# Altium project Jewel_ESP32.PrjPcb
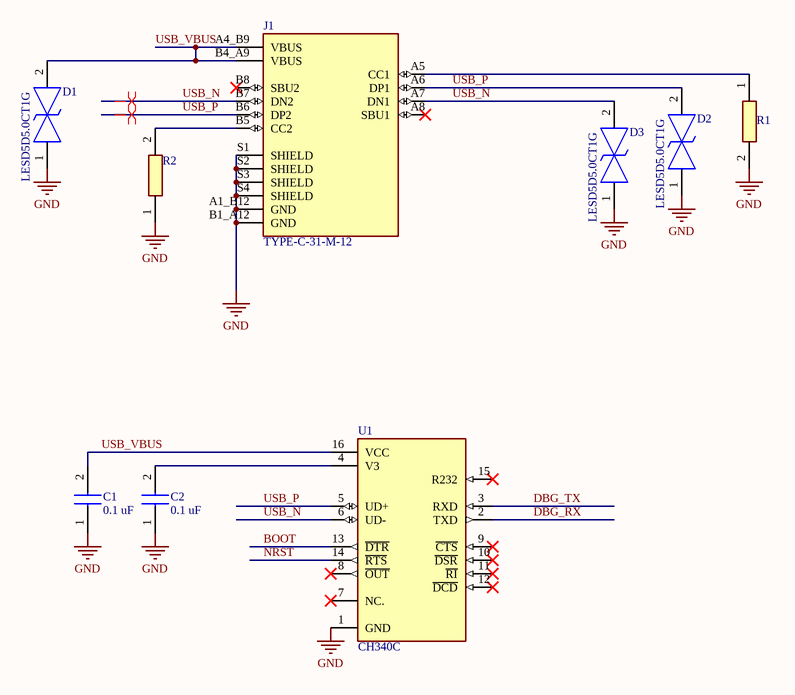
[diagram p0: programmer.SchDoc]
7 sheets, 133 parts. Net scope: global (net labels, ports and power ports of the same name join across sheets).
Board file: PCB1.PcbDoc
Sheets:
  programmer.SchDoc
  MCU.SchDoc
  PWR.SchDoc
  GSM.SchDoc
  RS485.SchDoc
  ADC.SchDoc
  DAC_OUT.SchDoc

## Sheet programmer.SchDoc
size A; SheetNumber: 1; SheetTotal: 7

### Parts
C1  0.1 uF  [CAP0603]
C2  0.1 uF  [CAP0603]
D1  LESD5D5.0CT1G  [LESD5D50CT1G]
D2  LESD5D5.0CT1G  [LESD5D50CT1G]
D3  LESD5D5.0CT1G  [LESD5D50CT1G]
J1  TYPE-C-31-M-12  [HRO_TYPE-C-31-M-12]
R1  CRCW0402100KFKEDHP  [RESC1005X40N]  (value not drawn)
R2  CRCW0402100KFKEDHP  [RESC1005X40N]  (value not drawn)
U1  CH340C  [SOIC127P600X180-16N]

### Nets
GND: C1.1 C2.1 D1.1 D2.1 D3.1 J1.A1_B12(GND) J1.B1_A12(GND) J1.S1(SHIELD) J1.S2(SHIELD) J1.S3(SHIELD) J1.S4(SHIELD) R1.2 R2.1 U1.1(GND)
BOOT: U1.13(~{DTR})
DBG_RX: U1.2(TXD)
DBG_TX: U1.3(RXD)
NRST: U1.14(~{RTS})
USB_N: D3.2 J1.A7(DN1) J1.B7(DN2) U1.6(UD-)
USB_P: D2.2 J1.A6(DP1) J1.B6(DP2) U1.5(UD+)
USB_VBUS: C1.2 D1.2 J1.A4_B9(VBUS) J1.B4_A9(VBUS) U1.16(VCC)
NetC2_2: C2.2 U1.4(V3)
NetJ1_A5: J1.A5(CC1) R1.1
NetJ1_B5: J1.B5(CC2) R2.2

Not connected (* = marked no-connect by the designer): J1 A8(SBU1)* B8(SBU2)*; U1 7(NC.)* 8(~{OUT})* 9(~{CTS})* 10(~{DSR})* 11(~{RI})* 12(~{DCD})* 15(R232)*

### Layout directives
differential pair: USB_N, USB_P

### Library data of the parts
C1 C2 = CC0603KRX7R9BB104: Capacitor; Manufacturer_Name: YAGEO; Datasheet Link: https://componentsearchengine.com/Datasheets/2/CC0603KRX7R9BB104.pdf; Height: 0.9mm; Manufacturer_Part_Number: CC0603KRX7R9BB104; Mouser Part Number: 603-CC603KRX7R9BB104; Mouser Price/Stock: https://www.mouser.co.uk/ProductDetail/YAGEO/CC0603KRX7R9BB104?qs=vTakOoo5QyLvVCYM2ge8LQ%3D%3D; Arrow Part Number: CC0603KRX7R9BB104; Arrow Price/Stock: https://www.arrow.com/en/products/cc0603krx7r9bb104/yageo?utm_currency=USD&region=europe
D1-D3 = LESD5D5.0CT1G: TVS Diode (Bi-directional); Manufacturer_Name: LRC; Height: 0.7mm; Manufacturer_Part_Number: LESD5D5.0CT1G
J1 = TYPE-C-31-M-12: USB Connectors 24 Receptacle 1 8.94*7.3mm RoHS; MF: HRO Electronics Co., Ltd.; SnapEDA_Link: https://www.snapeda.com/parts/TYPE-C-31-M-12/HRO+Electronics+Co.%252C+Ltd./view-part/?ref=snap; Package: Package; Value: *; MP: TYPE-C-31-M-12; Check_prices: https://www.snapeda.com/parts/TYPE-C-31-M-12/HRO+Electronics+Co.%252C+Ltd./view-part/?ref=eda
R1 R2 = CRCW0402100KFKEDHP: Resistor; Manufacturer_Name: Vishay; Datasheet Link: http://www.vishay.com/docs/20035/dcrcwe3.pdf; Height: 0.4mm; Manufacturer_Part_Number: CRCW0402100KFKEDHP; Mouser Part Number: 71-CRCW0402100KFKEDH; Mouser Price/Stock: https://www.mouser.co.uk/ProductDetail/Vishay-Dale/CRCW0402100KFKEDHP?qs=k2%2FDWSARqgGFakjlJe4Ejw%3D%3D; Arrow Part Number: CRCW0402100KFKEDHP; Arrow Price/Stock: https://www.arrow.com/en/products/crcw0402100kfkedhp/vishay?utm_currency=USD&region=nac
U1 = CH340C: USB to serial chip CH340; MF: WCH; Price: None; Availability: Not in stock; MP: CH340C; Package: None; SnapEDA_Link: https://www.snapeda.com/parts/CH340C/WCH/view-part/?ref=snap; Check_prices: https://www.snapeda.com/parts/CH340C/WCH/view-part/?ref=eda; Value: *

## Sheet MCU.SchDoc
size A3; SheetNumber: 2; SheetTotal: 7
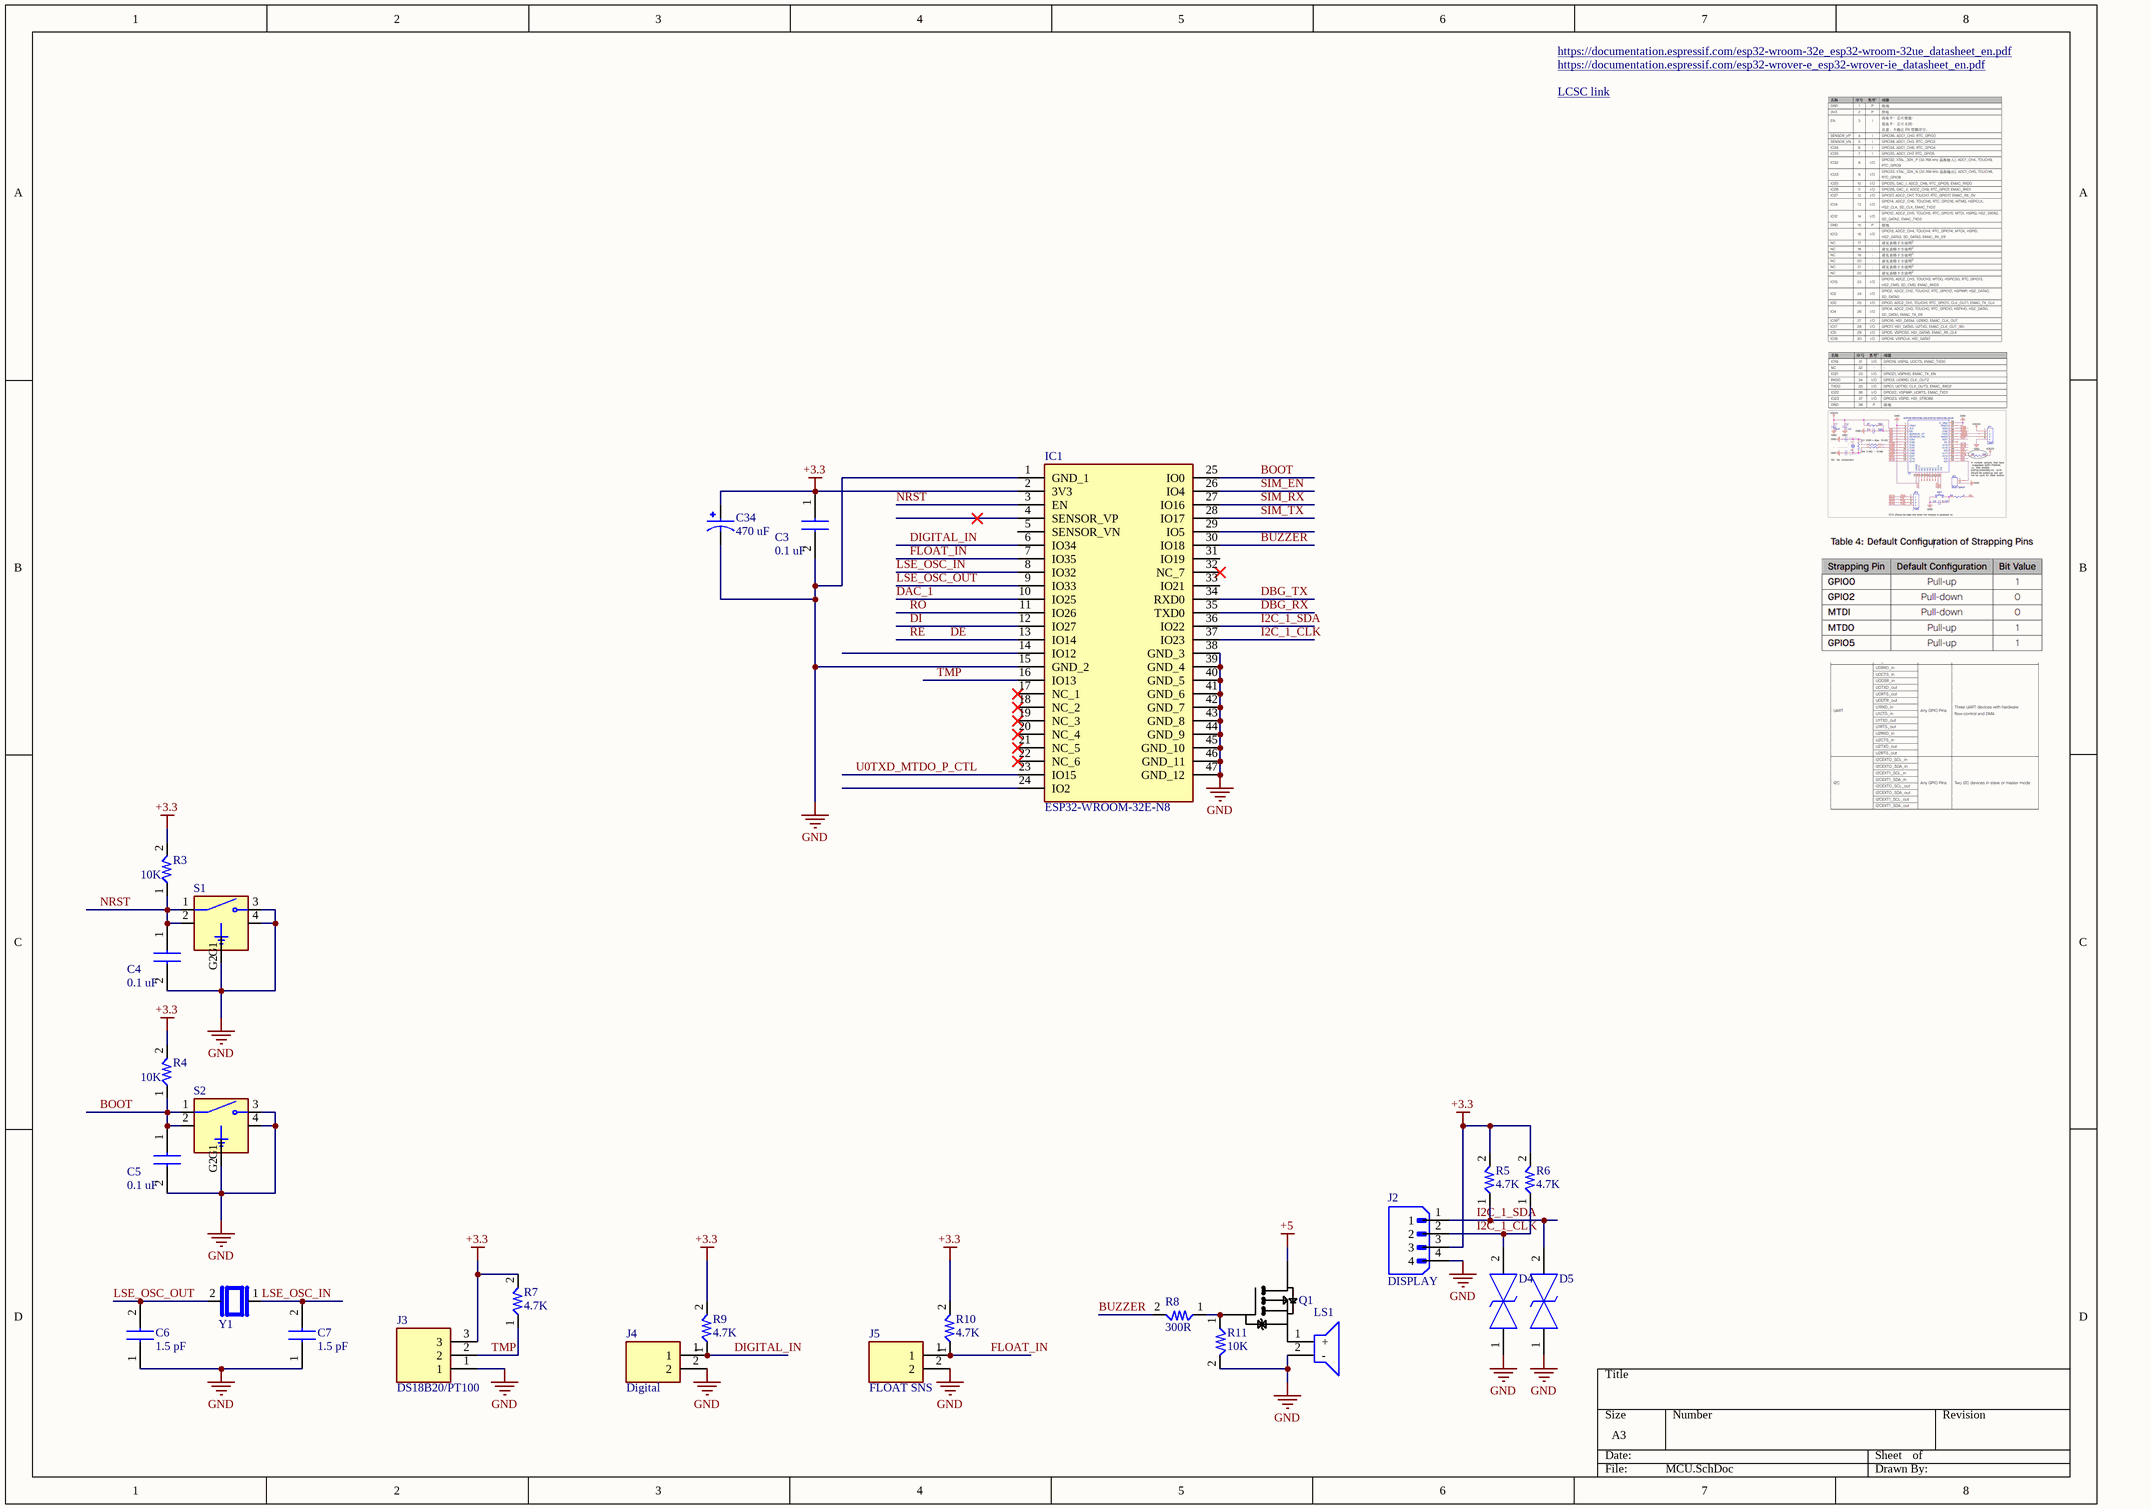
[diagram p1: MCU.SchDoc]

### Parts
C3  0.1 uF  [CAP0603]
C4  0.1 uF  [CAP0603]
C5  0.1 uF  [CAP0603]
C6  1.5 pF  [CAP0603]
C7  1.5 pF  [CAP0603]
C34  470 uF  [CAPPRD350W60D800H1150]
D4  DESD3V3Z1BCSF-7  [DESD3V3Z1BCSF7]  (value not drawn)
D5  DESD3V3Z1BCSF-7  [DESD3V3Z1BCSF7]  (value not drawn)
IC1  ESP32-WROOM-32E-N8  [ESP32WROOM32EN8]
J2  DISPLAY  [JST_B4B-XH-A(LF)(SN)]
J3  DS18B20/PT100  [2828153]
J4  Digital  [SHDRRA2W102P0X508_1X2_1016X1200X850P]
J5  FLOAT SNS  [SHDRRA2W102P0X508_1X2_1016X1200X850P]
LS1  CMI-1295IC-0585T  [CMI1295IC0585T]  (value not drawn)
Q1  DMG3415U-7  [SOT96P240X110-3N]  (value not drawn)
R3  10K  [RES0603]
R4  10K  [RES0603]
R5  4.7K  [RES0603]
R6  4.7K  [RES0603]
R7  4.7K  [RES0603]
R8  300R  [RES0603]
R9  4.7K  [RES0603]
R10  4.7K  [RES0603]
R11  10K  [RES0603]
S1  PTS526_SMG15_SMTR2_LFS  [SW_PTS526_SMG15_SMTR2_LFS]  (value not drawn)
S2  PTS526_SMG15_SMTR2_LFS  [SW_PTS526_SMG15_SMTR2_LFS]  (value not drawn)
Y1  CM8V-T1A-32.768KHZ-6PF-20PPM-TA-QC  [XTAL_CM8V-T1A-32.768KHZ-6PF-20PPM-TA-QC]  (value not drawn)

### Nets
+3.3: C3.1 C34.P IC1.2(3V3) J2.3 J3.3 R3.2 R4.2 R5.2 R6.2 R7.2 R9.2 R10.2
+5: Q1.3(D)
GND: C3.2 C4.2 C5.2 C6.1 C7.1 C34.N D4.1 D5.1 IC1.1(GND_1) IC1.15(GND_2) IC1.38(GND_3) IC1.39(GND_4) IC1.40(GND_5) IC1.41(GND_6) IC1.42(GND_7) IC1.43(GND_8) IC1.44(GND_9) IC1.45(GND_10) IC1.46(GND_11) IC1.47(GND_12) J2.4 J3.1 J4.2 J5.2 LS1.2(-) R11.2 S1.3(NO) S1.4(NO) S1.G2(GND) S2.3(NO) S2.4(NO) S2.G2(GND)
BOOT: C5.1 IC1.25(IO0) R4.1 S2.1(COM) S2.2(COM)
BUZZER: IC1.30(IO18) R8.2
DAC_1: IC1.10(IO25)
DBG_RX: IC1.35(TXD0)
DBG_TX: IC1.34(RXD0)
DE: IC1.13(IO14)  [also labelled RE]
DI: IC1.12(IO27)
DIGITAL_IN: IC1.6(IO34) J4.1 R9.1
FLOAT_IN: IC1.7(IO35) J5.1 R10.1
I2C_1_CLK: D4.2 IC1.37(IO23) J2.2 R6.1
I2C_1_SDA: D5.2 IC1.36(IO22) J2.1 R5.1
LSE_OSC_IN: C7.2 IC1.8(IO32) Y1.1
LSE_OSC_OUT: C6.2 IC1.9(IO33) Y1.2
NRST: C4.1 IC1.3(EN) R3.1 S1.1(COM) S1.2(COM)
RO: IC1.11(IO26)
SIM_EN: IC1.26(IO4)
SIM_RX: IC1.27(IO16)
SIM_TX: IC1.28(IO17)
TMP: IC1.16(IO13) J3.2 R7.1
U0TXD_MTDO_P_CTL: IC1.23(IO15)
NetLS1_1: LS1.1(+) Q1.2(S)
NetQ1_1: Q1.1(G) R8.1 R11.1

Not connected (* = marked no-connect by the designer): IC1 4(SENSOR_VP)* 5(SENSOR_VN) 14(IO12) 17(NC_1)* 18(NC_2)* 19(NC_3)* 20(NC_4)* 21(NC_5)* 22(NC_6)* 24(IO2) 29(IO5) 31(IO19) 32(NC_7)* 33(IO21); S1 G1(GND); S2 G1(GND)

### Notes on the sheet
- https://documentation.espressif.com/esp32-wroom-32e_esp32-wroom-32ue_datasheet_en.pdf
- https://documentation.espressif.com/esp32-wrover-e_esp32-wrover-ie_datasheet_en.pdf
- LCSC link <https://www.lcsc.com/product-detail/C701342.html?s_z=n_q_t_esp32&spm=wm.fly.bg.3.xh___wm.ssy.tc.0.tz&lcsc_vid=EVJdVVYDQlEPAgBWRwALVwJWFlQKUQJQQwdXUVRSQFIxVlNeRlBXXlJfTlRXVDsOAxUeFF5JWBYZEEoKFBINSQcJGk4dAgUUFAk%3D>

### Library data of the parts
C3-C7 = CC0603KRX7R9BB104: Capacitor; Manufacturer_Name: YAGEO; Datasheet Link: https://componentsearchengine.com/Datasheets/2/CC0603KRX7R9BB104.pdf; Height: 0.9mm; Manufacturer_Part_Number: CC0603KRX7R9BB104; Mouser Part Number: 603-CC603KRX7R9BB104; Mouser Price/Stock: https://www.mouser.co.uk/ProductDetail/YAGEO/CC0603KRX7R9BB104?qs=vTakOoo5QyLvVCYM2ge8LQ%3D%3D; Arrow Part Number: CC0603KRX7R9BB104; Arrow Price/Stock: https://www.arrow.com/en/products/cc0603krx7r9bb104/yageo?utm_currency=USD&region=europe
C34 = EEUFC1E221: 220F 25V Aluminum Electrolytic Capacitors Radial, Can 2000 Hrs @ 105C; MF: Panasonic; Package: RADIAL-2 Panasonic; Price: None; Purchase-URL: https://pricing.snapeda.com/search/part/EEUFC1E221/?ref=eda; Value: *; Check_prices: https://www.snapeda.com/parts/EEUFC1E221/Panasonic/view-part/?ref=eda; MP: EEUFC1E221; SnapEDA_Link: https://www.snapeda.com/parts/EEUFC1E221/Panasonic/view-part/?ref=snap; Availability: In Stock
D4 D5 = DESD3V3Z1BCSF-7: TVS Diode (Bi-directional); Manufacturer_Name: Diodes Incorporated; Datasheet Link: https://www.diodes.com/assets/Package-Files/X2-WLB0603-2.pdf; Height: 0.32mm; Manufacturer_Part_Number: DESD3V3Z1BCSF-7; Mouser Part Number: 621-DESD3V3Z1BCSF-7; Mouser Price/Stock: https://www.mouser.co.uk/ProductDetail/Diodes-Incorporated/DESD3V3Z1BCSF-7?qs=HXFqYaX1Q2xS5VnKZuyjmg%3D%3D; Arrow Part Number: DESD3V3Z1BCSF-7; Arrow Price/Stock: https://www.arrow.com/en/products/desd3v3z1bcsf-7/diodes-incorporated?utm_currency=USD&region=nac
IC1 = ESP32-WROOM-32E-N8: Integrated Circuit; Manufacturer_Name: Espressif Systems; Datasheet Link: https://www.google.com/url?sa=t&rct=j&q=&esrc=s&source=web&cd=&ved=2ahUKEwjLw4ysybv2AhXFzIUKHZUbB64QFnoECCwQAQ&url=https%3A%2F%2Fwww.espressif.com%2Fsites%2Fdefault%2Ffiles%2Fdocumentation%2Fesp32-wroom-32e_esp32-wroom-32ue_datasheet_en.pdf&usg=AOvVaw1xSL; Height: 3.25mm; Manufacturer_Part_Number: ESP32-WROOM-32E-N8; Mouser Part Number: 356-ESP32WRM32E164PH; Mouser Price/Stock: https://www.mouser.co.uk/ProductDetail/Espressif-Systems/ESP32-WROOM-32E-N8?qs=Li%252BoUPsLEnsLnZW%252BGLgUhw%3D%3D
J2 = B4B-XH-A(LF)(SN): Connector Header Through Hole 4 position 0.098 (2.50mm); MF: JST Sales; SnapEDA_Link: https://www.snapeda.com/parts/B4B-XH-A(LF)(SN)/JST+Sales+America+Inc./view-part/?ref=snap; Package: None; Value: *; MP: B4B-XH-A(LF)(SN); Check_prices: https://www.snapeda.com/parts/B4B-XH-A(LF)(SN)/JST+Sales+America+Inc./view-part/?ref=eda
J3 = 282815-3: Connector; Manufacturer_Name: TE Connectivity; Datasheet Link: https://www.te.com/commerce/DocumentDelivery/DDEController?Action=srchrtrv&DocNm=1-773958-1&DocType=Data%20Sheet&DocLang=English&PartCntxt=282815-3&DocFormat=pdf; Height: 8.35mm; Manufacturer_Part_Number: 282815-3; Mouser Part Number: 571-282815-3; Mouser Price/Stock: https://www.mouser.co.uk/ProductDetail/TE-Connectivity/282815-3?qs=79%2FjLZ2kXkqd6grVMiPYfw%3D%3D; Arrow Part Number: 282815-3; Arrow Price/Stock: https://www.arrow.com/en/products/282815-3/te-connectivity
J4 J5 = 282815-2: Connector; Manufacturer_Name: TE Connectivity; Datasheet Link: https://www.te.com/commerce/DocumentDelivery/DDEController?Action=srchrtrv&DocNm=1-773958-1&DocType=Data%20Sheet&DocLang=English&PartCntxt=282815-2&DocFormat=pdf; Height: 8.5mm; Manufacturer_Part_Number: 282815-2; Mouser Part Number: 571-282815-2; Mouser Price/Stock: https://www.mouser.co.uk/ProductDetail/TE-Connectivity/282815-2?qs=79%2FjLZ2kXkpF7MFURi982A%3D%3D; Arrow Part Number: 282815-2; Arrow Price/Stock: https://www.arrow.com/en/products/282815-2/te-connectivity?region=nac
LS1 = CMI-1295IC-0585T: Loudspeaker or Buzzer; Manufacturer_Name: Same Sky; Datasheet Link: https://www.sameskydevices.com/product/resource/CMI-1295IC-0585T.pdf; Height: 9.7mm; Manufacturer_Part_Number: CMI-1295IC-0585T; Mouser Part Number: 490-CMI-1295IC-0585T; Mouser Price/Stock: https://www.mouser.co.uk/ProductDetail/Same-Sky/CMI-1295IC-0585T?qs=OlC7AqGiEDkuskN%2Fok3iNw%3D%3D; Arrow Part Number: CMI-1295IC-0585T; Arrow Price/Stock: https://www.arrow.com/en/products/cmi-1295ic-0585t/cui-devices?utm_currency=USD&region=nac
Q1 = DMG3415U-7: Integrated Circuit; Manufacturer_Name: Lattice Semiconductor; Datasheet Link: https://media.digikey.com/pdf/Data%20Sheets/Diodes%20PDFs/DMG3415U.pdf; Height: 1.1mm; Manufacturer_Part_Number: DMG3415U-7; Mouser Part Number: N/A; Mouser Price/Stock: https://www.mouser.com/Search/Refine.aspx?Keyword=N%2FA
R3-R11 = RES: Resistor; Manufacturer_Name: UNI-ROYAL(Uniroyal Elec); Manufacturer_Part_Number: 0603WAF1001T5E; Datasheet Link: https://datasheet.lcsc.com/szlcsc/Uniroyal-Elec-0603WAF1001T5E_C21190.pdf; Height: 0.55mm
S1 S2 = PTS526_SMG15_SMTR2_LFS: Tactile Switch SPST-NO Top Actuated Surface Mount; MP: PTS526 SMG15 SMTR2 LFS; MF: C&K; Availability: In Stock; SnapEDA_Link: https://www.snapeda.com/parts/PTS526%20SMG15%20SMTR2%20LFS/C%2526K/view-part/?ref=snap; Value: *; Package: None; Price: None; Purchase-URL: https://pricing.snapeda.com/search/part/PTS526 SMG15 SMTR2 LFS/?ref=eda; Check_prices: https://www.snapeda.com/parts/PTS526%20SMG15%20SMTR2%20LFS/C%2526K/view-part/?ref=eda
Y1 = CM8V-T1A-32.768KHZ-6PF-20PPM-TA-QC: Tuning Fork Crystal 32.768kHz in SMD 1.2 x 2.0mm package; MF: Micro Crystal; SnapEDA_Link: https://www.snapeda.com/parts/CM8V-T1A-32.768kHz-6pF-20PPM-TA-QC/Micro+Crystal/view-part/?ref=snap; Package: SMD-2 Micro Crystal; Value: *; MP: CM8V-T1A-32.768kHz-6pF-20PPM-TA-QC; Check_prices: https://www.snapeda.com/parts/CM8V-T1A-32.768kHz-6pF-20PPM-TA-QC/Micro+Crystal/view-part/?ref=eda

## Sheet PWR.SchDoc
size A; SheetNumber: 3; SheetTotal: 7
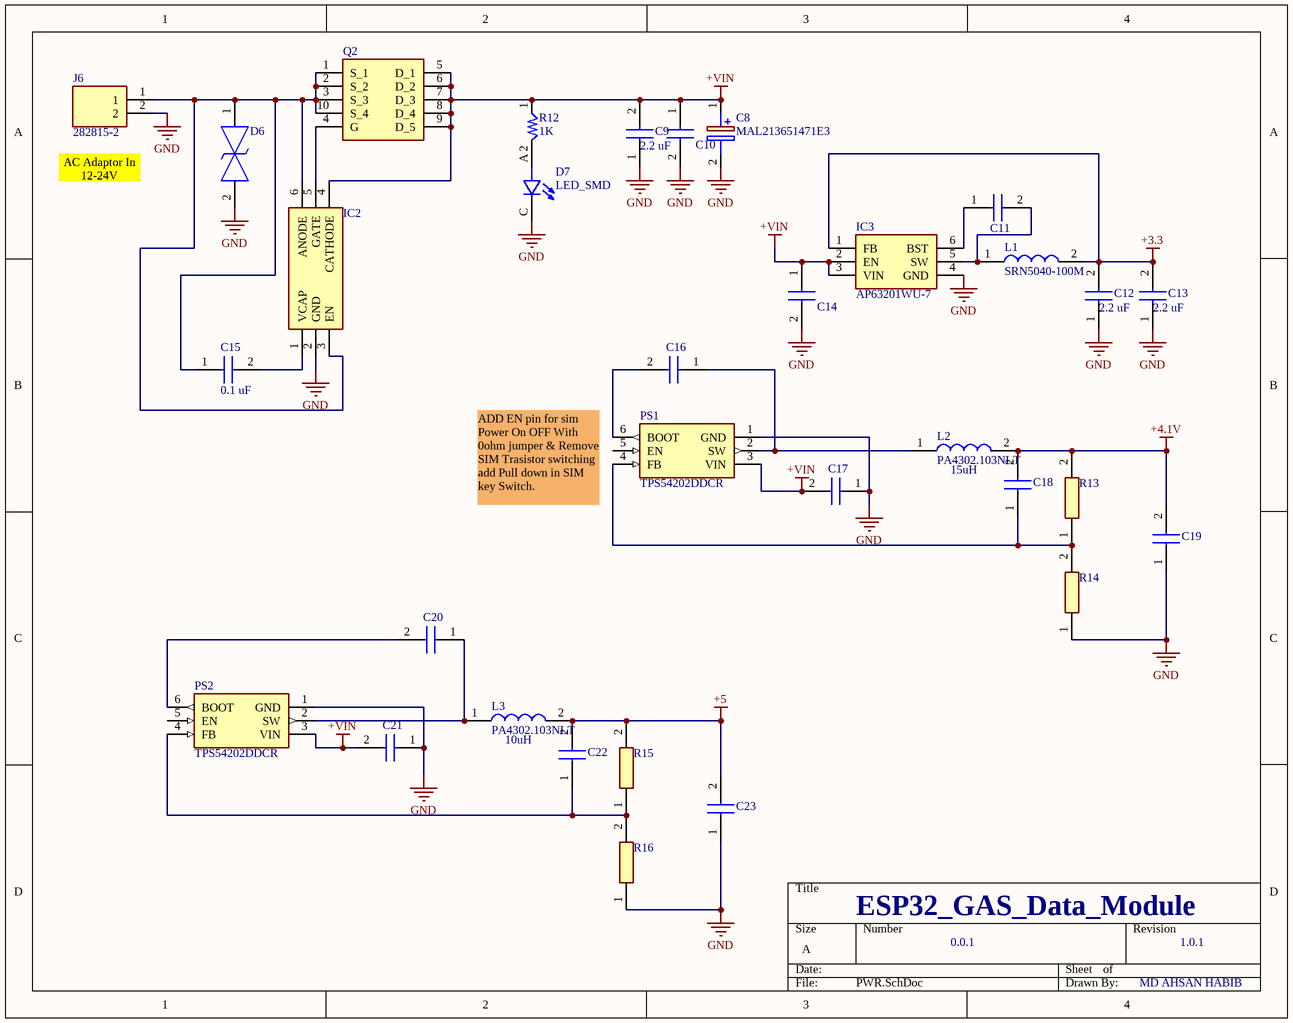
[diagram p2: PWR.SchDoc]

### Parts
C8  MAL213651471E3  [CAPPRD500W60D1300H2700]
C9  2.2 uF  [CAP0603]
C10  C5750X5R1H106K230KA  [C5750_Commercial]  (value not drawn)
C11  C0805C104M5RAC-TU  [CAP0603]  (value not drawn)
C12  2.2 uF  [CAP0603]
C13  2.2 uF  [CAP0603]
C14  C5750X5R1H106K230KA  [CAP0603]  (value not drawn)
C15  0.1 uF  [CAP0603]
C16  C0805C104M5RAC-TU  [CAPC2012X88N]  (value not drawn)
C17  C5750X5R1H106K230KA  [CAP0603]  (value not drawn)
C18  GRM0335C1E560JA01D  [CAP0603]  (value not drawn)
C19  GRM32ER61C476KE15L  [CAPC3225X270N]  (value not drawn)
C20  C0805C104M5RAC-TU  [CAPC2012X88N]  (value not drawn)
C21  C5750X5R1H106K230KA  [CAP0603]  (value not drawn)
C22  CGA1A2C0G1E820J030BA  [CAP0603]  (value not drawn)
C23  GRM32ER61C476KE15L  [CAPC3225X270N]  (value not drawn)
D6  SMBJ24CA-13-F  [DIONM5336X250N]  (value not drawn)
D7  LED_SMD  [LEDSC125X200X90-2N]
IC2  LM74700QDBVTQ1  [SOT95P280X145-6N]  (value not drawn)
IC3  AP63201WU-7  [SOT95P280X100-6N]
J6  282815-2  [SHDRRA2W102P0X508_1X2_1016X1200X850P]
L1  SRN5040-100M  [SRN5040]
L2  PA4302.103NLT  [PA4302103NLT]
L3  PA4302.103NLT  [PA4302103NLT]
PS1  TPS54202DDCR  [SOT95P280X110-6N]
PS2  TPS54202DDCR  [SOT95P280X110-6N]
Q2  BSC014N06NSATMA1  [BSC010N04LS6ATMA1]  (value not drawn)
R12  1K  [RES0603]
R13  CRCW0402100KFKEDHP  [RES0603]  (value not drawn)
R14  CRCW040216K9FKEDHP  [RES0603]  (value not drawn)
R15  CRCW0402100KFKEDHP  [RES0603]  (value not drawn)
R16  CRCW040213K7FKEDHP  [RES0603]  (value not drawn)

### Nets
+3.3: C12.2 C13.2 IC3.1(FB) L1.2
+4.1V: C18.2 C19.2 L2.2 R13.2
+5: C22.2 C23.2 L3.2 R15.2
+VIN: C8.1(+) C9.2 C10.1 C14.1 C17.2 C21.2 IC2.4(CATHODE) IC3.2(EN) IC3.3(VIN) PS1.3(VIN) PS2.3(VIN) Q2.5(D_1) Q2.6(D_2) Q2.7(D_3) Q2.8(D_4) Q2.9(D_5) R12.1
GND: C8.2(-) C9.1 C10.2 C12.1 C13.1 C14.2 C17.1 C19.1 C21.1 C23.1 D6.2 D7.C IC2.2(GND) IC3.4(GND) J6.2 PS1.1(GND) PS2.1(GND) R14.1 R16.1
NetC11_1: C11.1 IC3.6(BST)
NetC11_2: C11.2 IC3.5(SW) L1.1
NetC15_1: C15.1 D6.1 IC2.3(EN) IC2.6(ANODE) J6.1 Q2.1(S_1) Q2.2(S_2) Q2.3(S_3) Q2.10(S_4)
NetC15_2: C15.2 IC2.1(VCAP)
NetC16_1: C16.1 L2.1 PS1.2(SW)
NetC16_2: C16.2 PS1.6(BOOT)
NetC18_1: C18.1 PS1.4(FB) R13.1 R14.2
NetC20_1: C20.1 L3.1 PS2.2(SW)
NetC20_2: C20.2 PS2.6(BOOT)
NetC22_1: C22.1 PS2.4(FB) R15.1 R16.2
NetD7_A: D7.A R12.2
NetIC2_5: IC2.5(GATE) Q2.4(G)

Not connected (* = marked no-connect by the designer): PS1 5(EN); PS2 5(EN)

### Notes on the sheet
- (near J6) AC Adaptor In 12-24V
- (near PS1) ADD EN pin for sim Power On OFF With 0ohm jumper & Remove SIM Trasistor switching add Pull down in SIM key Switch.
- (near L2) 15uH
- (near L3) 10uH
- ESP32_GAS_Data_Module
- 0.0.1
- 1.0.1
- MD AHSAN HABIB

### Library data of the parts
C8 = MAL213651471E3: Capacitor Polarised; Manufacturer_Name: Vishay; Datasheet Link: https://www.mouser.co.uk/datasheet/2/427/136rvi-1762300.pdf; Height: 27mm; Manufacturer_Part_Number: MAL213651471E3; Mouser Part Number: 594-2222-136-51471; Mouser Price/Stock: https://www.mouser.co.uk/ProductDetail/Vishay-BC-Components/MAL213651471E3?qs=zGH8QOQ14qXx9%252BWDTpPwWA%3D%3D
C9 C12 C13 C15 = CC0603KRX7R9BB104: Capacitor; Manufacturer_Name: YAGEO; Datasheet Link: https://componentsearchengine.com/Datasheets/2/CC0603KRX7R9BB104.pdf; Height: 0.9mm; Manufacturer_Part_Number: CC0603KRX7R9BB104; Mouser Part Number: 603-CC603KRX7R9BB104; Mouser Price/Stock: https://www.mouser.co.uk/ProductDetail/YAGEO/CC0603KRX7R9BB104?qs=vTakOoo5QyLvVCYM2ge8LQ%3D%3D; Arrow Part Number: CC0603KRX7R9BB104; Arrow Price/Stock: https://www.arrow.com/en/products/cc0603krx7r9bb104/yageo?utm_currency=USD&region=europe
C10 C14 C17 C21 = C5750X5R1H106K230KA: Capacitor; Manufacturer_Name: TDK; Datasheet Link: https://product.tdk.com/system/files/dam/doc/product/capacitor/ceramic/mlcc/catalog/mlcc_commercial_general_en.pdf; Height: 2.5mm; Manufacturer_Part_Number: C5750X5R1H106K230KA; Mouser Part Number: 810-C5750X5R1H106K; Mouser Price/Stock: https://www.mouser.co.uk/ProductDetail/TDK/C5750X5R1H106K230KA?qs=NRhsANhppD8lVYAvl0MZ3g%3D%3D; Arrow Part Number: C5750X5R1H106K230KA; Arrow Price/Stock: https://www.arrow.com/en/products/c5750x5r1h106k230ka/tdk?region=nac
C11 C16 C20 = C0805C104M5RAC-TU: Capacitor; Manufacturer_Name: Yageo Group; Datasheet Link: https://connect.kemet.com:7667/gateway/IntelliData-ComponentDocumentation/1.0/download/specsheet/C0805C104M5RACTU; Height: 0.88mm; Manufacturer_Part_Number: C0805C104M5RAC-TU; Arrow Part Number: C0805C104M5RAC-TU; Arrow Price/Stock: https://www.arrow.com/en/products/c0805c104m5ractu/kemet-corporation?region=nac
C18 = GRM0335C1E560JA01D: Capacitor; Manufacturer_Name: Murata Electronics; Height: 0.33mm; Manufacturer_Part_Number: GRM0335C1E560JA01D; Mouser Part Number: 81-GRM0335C1E560JA1D; Mouser Price/Stock: https://www.mouser.com/Search/Refine.aspx?Keyword=81-GRM0335C1E560JA1D; Arrow Part Number: GRM0335C1E560JA01D; Arrow Price/Stock: https://www.arrow.com/en/products/grm0335c1e560ja01d/murata-manufacturing
C19 C23 = GRM32ER61C476KE15L: Capacitor; Manufacturer_Name: Murata Electronics; Datasheet Link: https://search.murata.co.jp/Ceramy/image/img/A01X/G101/ENG/GRM32ER61C476KE15-01A.pdf; Height: 2.7mm; Manufacturer_Part_Number: GRM32ER61C476KE15L; Mouser Part Number: 81-GRM32ER61C476KE5L; Mouser Price/Stock: https://www.mouser.co.uk/ProductDetail/Murata-Electronics/GRM32ER61C476KE15L?qs=%252B%2F7tQhzlcy7Im%2F1Gh2YSGQ%3D%3D; Arrow Part Number: GRM32ER61C476KE15L; Arrow Price/Stock: https://www.arrow.com/en/products/grm32er61c476ke15l/murata-manufacturing?utm_currency=USD&region=europe
C22 = CGA1A2C0G1E820J030BA: Capacitor; Manufacturer_Name: TDK; Datasheet Link: https://product.tdk.com/system/files/dam/doc/product/capacitor/ceramic/mlcc/catalog/mlcc_automotive_general_en.pdf; Height: 0.33mm; Manufacturer_Part_Number: CGA1A2C0G1E820J030BA
D6 = SMBJ24CA-13-F: TVS Diode (Bi-directional); Manufacturer_Name: Diodes Incorporated; Datasheet Link: https://www.diodes.com/assets/Datasheets/ds19002.pdf; Height: 2.5mm; Manufacturer_Part_Number: SMBJ24CA-13-F; Mouser Part Number: 621-SMBJ24CA-13-F; Mouser Price/Stock: https://www.mouser.co.uk/ProductDetail/Diodes-Incorporated/SMBJ24CA-13-F?qs=gaDBXWSqsDCkhBi9r6ReOQ%3D%3D; Arrow Part Number: SMBJ24CA-13-F; Arrow Price/Stock: https://www.arrow.com/en/products/smbj24ca-13-f/diodes-incorporated?utm_currency=USD&region=nac
D7 = 5990110007F: Red 633nm LED Indication - Discrete 2.1V 0805 (2012 Metric); MF: Dialight; MP: 599-0110-007F; Check_prices: https://www.snapeda.com/parts/599-0110-007F/Dialight/view-part/?ref=eda; Value: *; Purchase-URL: https://pricing.snapeda.com/search/part/599-0110-007F/?ref=eda; Price: None; SnapEDA_Link: https://www.snapeda.com/parts/599-0110-007F/Dialight/view-part/?ref=snap; Availability: In Stock; Package: 0805 Dialight
IC2 = LM74700-Q1MKX-1_NOPB: Integrated Circuit; Manufacturer_Name: Texas Instruments; Manufacturer_Part_Number: LM74700-Q1MKX-1/NOPB; Datasheet Link: http://www.ti.com/lit/ds/symlink/lm74700-q1.pdf; Height: 1.45mm
IC3 = AP63201WU-7: Integrated Circuit; Manufacturer_Name: Diodes Incorporated; Datasheet Link: https://www.diodes.com//assets/Datasheets/AP63200-AP63201-AP63203-AP63205.pdf; Height: 1mm; Manufacturer_Part_Number: AP63201WU-7; Mouser Part Number: 621-AP63201WU-7; Mouser Price/Stock: https://www.mouser.co.uk/ProductDetail/Diodes-Incorporated/AP63201WU-7?qs=u16ybLDytRaVD%252BU3eG30NA%3D%3D; Arrow Part Number: AP63201WU-7; Arrow Price/Stock: https://www.arrow.com/en/products/ap63201wu-7/diodes-incorporated?utm_currency=USD&region=nac
J6 = 282815-2: as J4 on sheet MCU; Datasheet Link: https://www.te.com/commerce/DocumentDelivery/DDEController?Action=srchrtrv&DocNm=1-773958-1&DocType=Data%20Sheet&DocLang=English&PartCntxt=282815-2&DocFormat=pdf; Height: 8.5mm; Manufacturer_Part_Number: 282815-2; Mouser Part Number: 571-282815-2; Mouser Price/Stock: https://www.mouser.co.uk/ProductDetail/TE-Connectivity/282815-2?qs=79%2FjLZ2kXkpF7MFURi982A%3D%3D; Arrow Part Number: 282815-2; Arrow Price/Stock: https://www.arrow.com/en/products/282815-2/te-connectivity?region=nac
L1 = SRN5040-100M: Inductor; Manufacturer_Name: Bourns; Datasheet Link: https://www.bourns.com/docs/Product-Datasheets/SRN5040.pdf; Manufacturer_Part_Number: SRN5040-100M; Mouser Part Number: 652-SRN5040-100M; Mouser Price/Stock: https://www.mouser.co.uk/ProductDetail/Bourns/SRN5040-100M?qs=U0ECReq1GB9FT5dcc%2FWaRA%3D%3D; Arrow Part Number: SRN5040-100M; Arrow Price/Stock: https://www.arrow.com/en/products/srn5040-100m/bourns?utm_currency=USD&region=europe
L2 L3 = PA4302.103NLT: Inductor; Manufacturer_Name: Yageo Group; Datasheet Link: https://www.mouser.com/datasheet/2/336/-559356.pdf; Height: 5.6mm; Manufacturer_Part_Number: PA4302.103NLT; Mouser Part Number: 673-PA4302.103NLT; Mouser Price/Stock: https://www.mouser.co.uk/ProductDetail/Pulse-Electronics/PA4302.103NLT?qs=ZU1dyKYMvyPXoPwo6qMOJg%3D%3D; Arrow Part Number: PA4302.103NLT; Arrow Price/Stock: https://www.arrow.com/en/products/pa4302.103nlt/pulse-electronics-corporation?region=nac
PS1 PS2 = TPS54202DDCR: Power Supply; Manufacturer_Name: Texas Instruments; Datasheet Link: http://www.ti.com/lit/gpn/tps54202; Height: 1.1mm; Manufacturer_Part_Number: TPS54202DDCR; Mouser Part Number: 595-TPS54202DDCR; Mouser Price/Stock: https://www.mouser.co.uk/ProductDetail/Texas-Instruments/TPS54202DDCR?qs=uP22XH7NdCsJtN%2Fq54jCtQ%3D%3D; Arrow Part Number: TPS54202DDCR; Arrow Price/Stock: https://www.arrow.com/en/products/tps54202ddcr/texas-instruments?utm_currency=USD&region=nac
Q2 = BSC014N06NSATMA1: MOSFET (N-Channel); Manufacturer_Name: Infineon; Datasheet Link: http://www.farnell.com/datasheets/1849651.html; Height: 1.1mm; Manufacturer_Part_Number: BSC014N06NSATMA1; Mouser Part Number: 726-BSC014N06NSATMA1; Mouser Price/Stock: https://www.mouser.co.uk/ProductDetail/Infineon-Technologies/BSC014N06NSATMA1?qs=K00xGehIljshgUA78G26tg%3D%3D; Arrow Part Number: BSC014N06NSATMA1; Arrow Price/Stock: https://www.arrow.com/en/products/bsc014n06nsatma1/infineon-technologies-ag?region=nac
R12 = RES: as R3 on sheet MCU; Datasheet Link: https://datasheet.lcsc.com/szlcsc/Uniroyal-Elec-0603WAF1001T5E_C21190.pdf; Height: 0.55mm
R13 R15 = CRCW0402100KFKEDHP: Resistor; Manufacturer_Name: Vishay; Datasheet Link: http://www.vishay.com/docs/20035/dcrcwe3.pdf; Height: 0.4mm; Manufacturer_Part_Number: CRCW0402100KFKEDHP; Mouser Part Number: 71-CRCW0402100KFKEDH; Mouser Price/Stock: https://www.mouser.co.uk/ProductDetail/Vishay-Dale/CRCW0402100KFKEDHP?qs=k2%2FDWSARqgGFakjlJe4Ejw%3D%3D; Arrow Part Number: CRCW0402100KFKEDHP; Arrow Price/Stock: https://www.arrow.com/en/products/crcw0402100kfkedhp/vishay?utm_currency=USD&region=nac
R14 = CRCW040216K9FKEDHP: Resistor; Manufacturer_Name: Vishay; Datasheet Link: http://www.vishay.com/docs/20035/dcrcwe3.pdf; Height: 0.4mm; Manufacturer_Part_Number: CRCW040216K9FKEDHP; Mouser Part Number: 71-CRCW040216K9FKEDH; Mouser Price/Stock: https://www.mouser.com/Search/Refine.aspx?Keyword=71-CRCW040216K9FKEDH
R16 = CRCW040213K7FKEDHP: Resistor; Manufacturer_Name: Vishay; Datasheet Link: http://www.vishay.com/docs/20035/dcrcwe3.pdf; Height: 0.4mm; Manufacturer_Part_Number: CRCW040213K7FKEDHP; Mouser Part Number: N/A; Mouser Price/Stock: https://www.mouser.co.uk/ProductDetail/Vishay-Dale/CRCW040213K7FKEDHP?qs=VAB4DzKv5wWcbGmoe9QIoA%3D%3D; Arrow Part Number: CRCW040213K7FKEDHP; Arrow Price/Stock: https://www.arrow.com/en/products/crcw040213k7fkedhp/vishay?region=nac

## Sheet GSM.SchDoc
size A; SheetNumber: 4; SheetTotal: 7
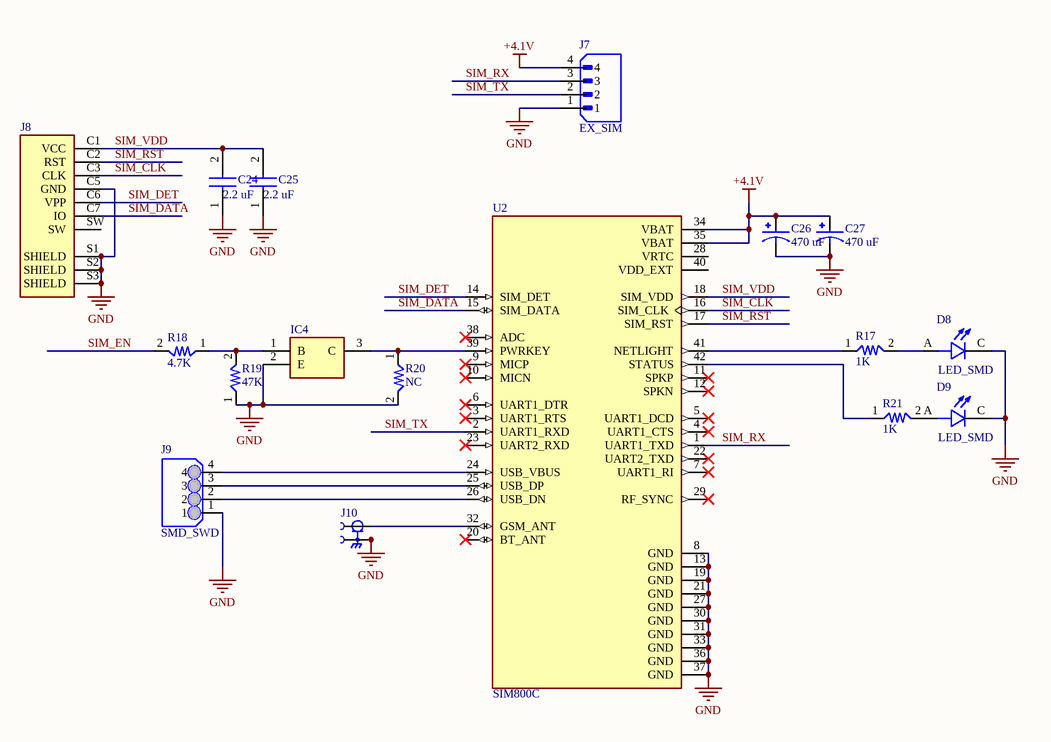
[diagram p3: GSM.SchDoc]

### Parts
C24  2.2 uF  [CAP0603]
C25  2.2 uF  [CAP0603]
C26  470 uF  [CAPPRD350W60D800H1150]
C27  470 uF  [CAPPRD350W60D800H1150]
D8  LED_SMD  [LEDSC125X200X90-2N]
D9  LED_SMD  [LEDSC125X200X90-2N]
IC4  MMBT2222ALT1G  [SOT96P237X111-3N]  (value not drawn)
J7  EX_SIM  [JST_B4B-XH-A(LF)(SN)]
J8  SIM8060-6-1-14-00-A  [GCT_SIM8060-6-1-14-00-A]  (value not drawn)
J9  SMD_SWD  [SMD_SWD]
J10  CONUFL001-SMD  [LINX_CONUFL001-SMD]  (value not drawn)
R17  1K  [RES0603]
R18  4.7K  [RES0603]
R19  47K  [RES0603]
R20  NC  [RES0603]
R21  1K  [RES0603]
U2  SIM800C  [LCC110P1570X1760X250-42N]

### Nets
+4.1V: C26.P C27.P J7.4 U2.34(VBAT) U2.35(VBAT)
GND: C24.1 C25.1 C26.N C27.N D8.C D9.C IC4.2(E) J7.1 J8.C5(GND) J8.S1(SHIELD) J8.S2(SHIELD) J8.S3(SHIELD) J9.1 J10.2 J10.3 R19.1 R20.2 U2.8(GND) U2.13(GND) U2.19(GND) U2.21(GND) U2.27(GND) U2.30(GND) U2.31(GND) U2.33(GND) U2.36(GND) U2.37(GND)
SIM_CLK: J8.C3(CLK) U2.16(SIM_CLK)
SIM_DATA: J8.C7(IO) U2.15(SIM_DATA)
SIM_DET: J8.C6(VPP) U2.14(SIM_DET)
SIM_EN: R18.2
SIM_RST: J8.C2(RST) U2.17(SIM_RST)
SIM_RX: J7.3 U2.1(UART1_TXD)
SIM_TX: J7.2 U2.2(UART1_RXD)
SIM_VDD: C24.2 C25.2 J8.C1(VCC) U2.18(SIM_VDD)
NetD8_A: D8.A R17.2
NetD9_A: D9.A R21.2
NetIC4_1: IC4.1(B) R18.1 R19.2
NetIC4_3: IC4.3(C) R20.1 U2.39(PWRKEY)
NetJ9_2: J9.2 U2.26(USB_DN)
NetJ9_3: J9.3 U2.25(USB_DP)
NetJ9_4: J9.4 U2.24(USB_VBUS)
NetJ10_1: J10.1 U2.32(GSM_ANT)
NetR17_1: R17.1 U2.41(NETLIGHT)
NetR21_1: R21.1 U2.42(STATUS)

Not connected (* = marked no-connect by the designer): J8 SW; U2 3(UART1_RTS)* 4(UART1_CTS)* 5(UART1_DCD)* 6(UART1_DTR)* 7(UART1_RI)* 9(MICP)* 10(MICN)* 11(SPKP)* 12(SPKN)* 20(BT_ANT)* 22(UART2_TXD)* 23(UART2_RXD)* 28(VRTC) 29(RF_SYNC)* 38(ADC)* 40(VDD_EXT)

### Library data of the parts
C24 C25 = CC0603KRX7R9BB104: Capacitor; Manufacturer_Name: YAGEO; Datasheet Link: https://componentsearchengine.com/Datasheets/2/CC0603KRX7R9BB104.pdf; Height: 0.9mm; Manufacturer_Part_Number: CC0603KRX7R9BB104; Mouser Part Number: 603-CC603KRX7R9BB104; Mouser Price/Stock: https://www.mouser.co.uk/ProductDetail/YAGEO/CC0603KRX7R9BB104?qs=vTakOoo5QyLvVCYM2ge8LQ%3D%3D; Arrow Part Number: CC0603KRX7R9BB104; Arrow Price/Stock: https://www.arrow.com/en/products/cc0603krx7r9bb104/yageo?utm_currency=USD&region=europe
C26 C27 = EEUFC1E221: as C34 on sheet MCU; Package: RADIAL-2 Panasonic; Price: None; Purchase-URL: https://pricing.snapeda.com/search/part/EEUFC1E221/?ref=eda; Value: *; Check_prices: https://www.snapeda.com/parts/EEUFC1E221/Panasonic/view-part/?ref=eda; MP: EEUFC1E221; SnapEDA_Link: https://www.snapeda.com/parts/EEUFC1E221/Panasonic/view-part/?ref=snap; Availability: In Stock
D8 D9 = 5990110007F: as D7 on sheet PWR; Check_prices: https://www.snapeda.com/parts/599-0110-007F/Dialight/view-part/?ref=eda; Value: *; Purchase-URL: https://pricing.snapeda.com/search/part/599-0110-007F/?ref=eda; Price: None; SnapEDA_Link: https://www.snapeda.com/parts/599-0110-007F/Dialight/view-part/?ref=snap; Availability: In Stock; Package: 0805 Dialight
IC4 = MMBT2222ALT1G: Integrated Circuit; Manufacturer_Name: Rochester Electronics; Datasheet Link: https://www.onsemi.com/pdf/datasheet/mmbt2222lt1-d.pdf; Height: 1.11mm; Manufacturer_Part_Number: MMBT2222ALT1G
J7 = B4B-XH-A(LF)(SN): as J2 on sheet MCU; SnapEDA_Link: https://www.snapeda.com/parts/B4B-XH-A(LF)(SN)/JST+Sales+America+Inc./view-part/?ref=snap; Package: None; Value: *; MP: B4B-XH-A(LF)(SN); Check_prices: https://www.snapeda.com/parts/B4B-XH-A(LF)(SN)/JST+Sales+America+Inc./view-part/?ref=eda
J8 = SIM8060-6-1-14-00-A: 6 Position Card Connector NANO SIM Surface Mount, Right Angle Gold; MF: Global Connector Technology; Package: Package Analog Devices; Value: *; Price: None; MP: SIM8060-6-1-14-00-A; SnapEDA_Link: https://www.snapeda.com/parts/SIM8060-6-1-14-00-A/Global%20Connector%20Technology/view-part/3075869/?ref=snap; Availability: Unavailable
J9 = SMD_SWD: Connector Header Through Hole 4 position 0.098 (2.50mm); MF: JST Sales; MP: B4B-XH-A(LF)(SN); SnapEDA_Link: https://www.snapeda.com/parts/B4B-XH-A(LF)(SN)/JST+Sales+America+Inc./view-part/?ref=snap; Package: None; Value: *; Check_prices: https://www.snapeda.com/parts/B4B-XH-A(LF)(SN)/JST+Sales+America+Inc./view-part/?ref=eda
J10 = CONUFL001-SMD: MF: Linx; Availability: In Stock; Price: None; SnapEDA_Link: https://www.snapeda.com/parts/CONUFL001-SMD/Linx/view-part/5842340/?ref=snap; Value: *; Check_prices: https://www.snapeda.com/parts/CONUFL001-SMD/Linx/view-part/5842340/?ref=eda; MP: CONUFL001-SMD; Package: None
R17-R21 = RES: as R3 on sheet MCU; Datasheet Link: https://datasheet.lcsc.com/szlcsc/Uniroyal-Elec-0603WAF1001T5E_C21190.pdf; Height: 0.55mm
U2 = SIM800C: Module: GSM/Bluetooth; GPRS; 2G; 1800MHz, 900MHz; 85.6kbps; SMD; MF: Simcom; Check_prices: https://www.snapeda.com/parts/SIM800C/SIMcom+Wireless+solutions+Co.%252CLtd/view-part/?ref=eda; Value: *; Availability: In Stock; MP: SIM800C; Price: None; Package: None; SnapEDA_Link: https://www.snapeda.com/parts/SIM800C/SIMcom+Wireless+solutions+Co.%252CLtd/view-part/?ref=snap

## Sheet RS485.SchDoc
size A; SheetNumber: 5; SheetTotal: 7
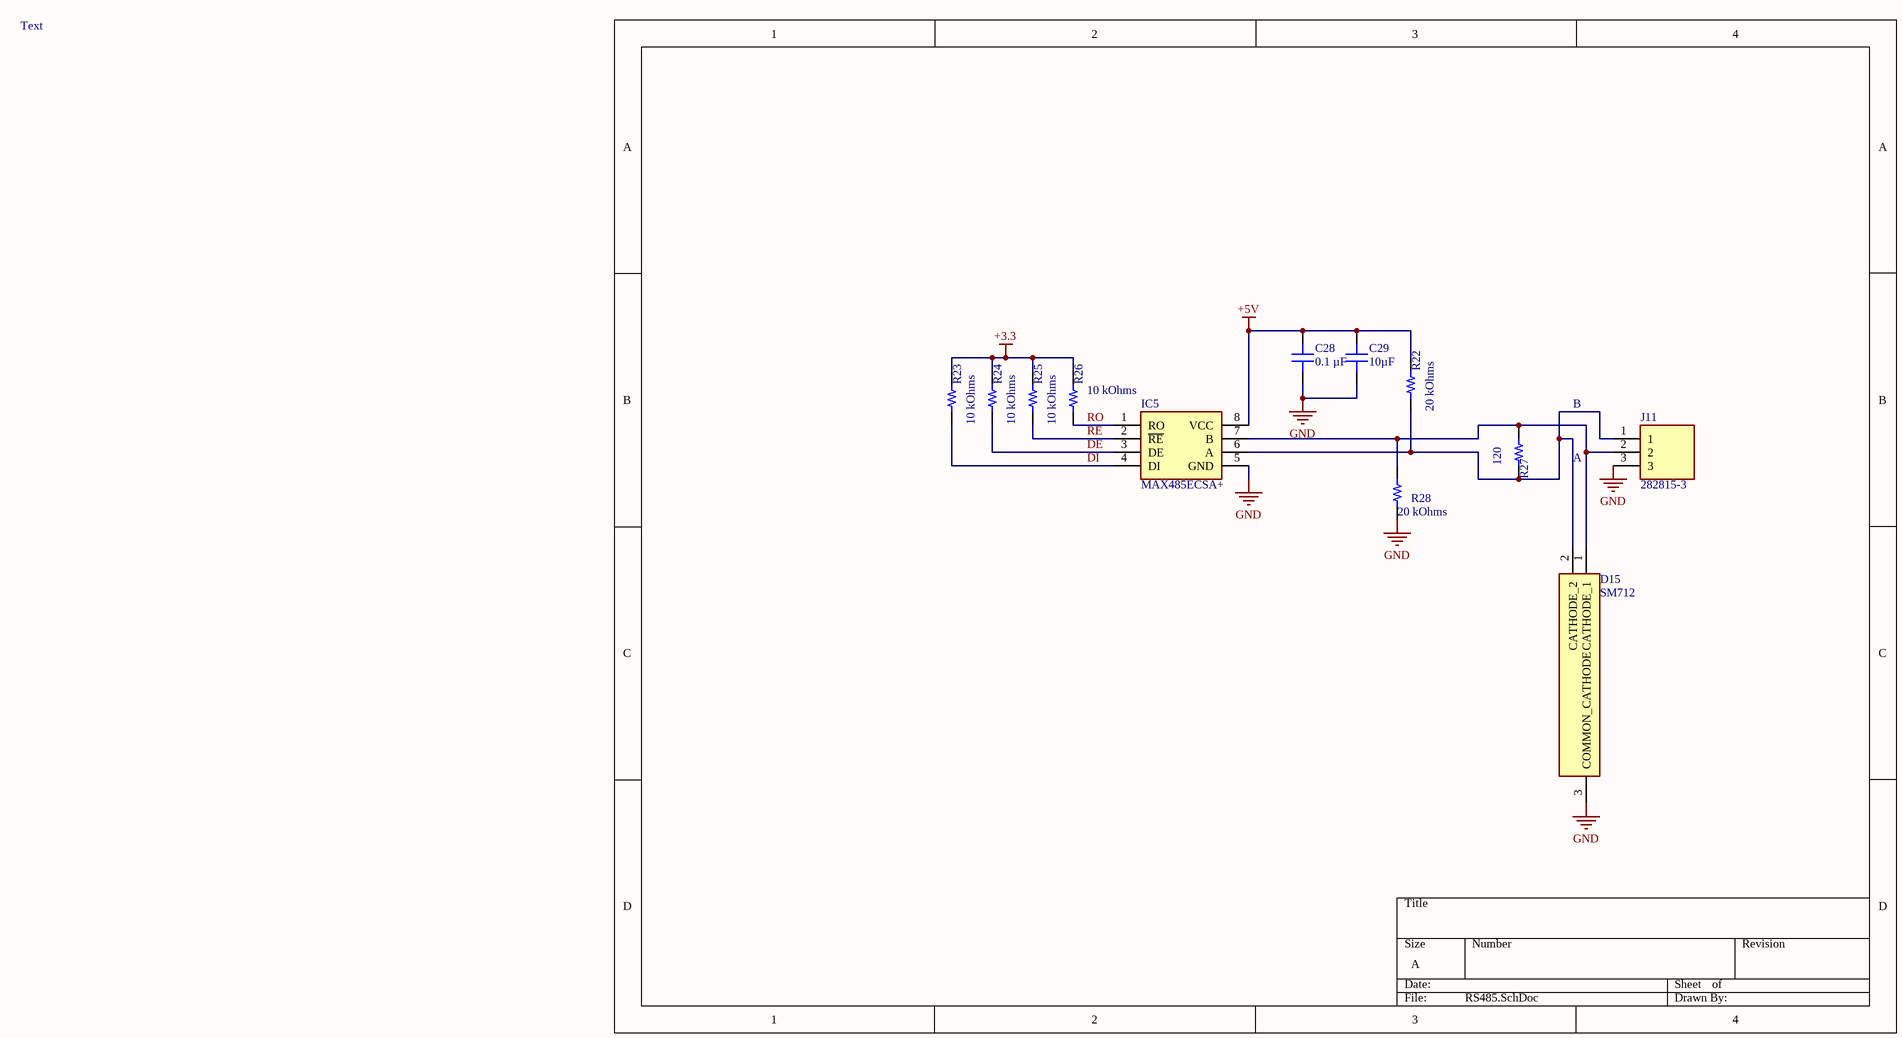
[diagram p4: RS485.SchDoc]

### Parts
C28  0.1 µF  [CAP 0603_1608]
C29  10µF  [CAP 1206_3216 - 1.8MM]
D15  SM712  [SOT95P240X115-3N]
IC5  MAX485ECSA+  [SOIC127P600X175-8N]
J11  282815-3  [2828153]
R22  20 kOhms  [RES 0603_1608]
R23  10 kOhms  [RES 0603_1608]
R24  10 kOhms  [RES 0603_1608]
R25  10 kOhms  [RES 0603_1608]
R26  10 kOhms  [RES 0603_1608]
R27  120  [RES 0603_1608]
R28  20 kOhms  [RES 0603_1608]

### Nets
+3.3: R23.2 R24.2 R25.2 R26.2
+5V: C28.2 C29.2 IC5.8(VCC) R22.2
GND: C28.1 C29.1 D15.3(COMMON_CATHODE) IC5.5(GND) J11.3 R28.1
DE: IC5.2(~{RE}) IC5.3(DE) R24.1 R25.1  [also labelled RE]
DI: IC5.4(DI) R23.1
RO: IC5.1(RO) R26.1
NetD15_1: D15.1(CATHODE_1) IC5.7(B) J11.2 R27.2 R28.2
NetD15_2: D15.2(CATHODE_2) IC5.6(A) J11.1 R22.1 R27.1

### Notes on the sheet
- Text
- B
- A

### Library data of the parts
C28 = C0603C104K5RAC7411: CAP CER 0.1UF 50V X7R 0603; manufacturer: KEMET; Tolerance: ±10%; Part Number: C0603C104K5RAC7411; Value: 0.1 µF; Applications: Bypass, Decoupling; Capacitance: 0.1 µF; componentlink1description: Datasheet; componentlink1url: https://api.kemet.com/component-edge/download/datasheet/C0603C104K5RAC7411.pdf; componentlink2description: DigiKey Link; componentlink2url: https://www.digikey.com/en/products/detail/kemet/C0603C104K5RAC7411/3317013; Device Package: 0603 (1608 Metric); lastupdated: 9/19/2022 1:01:20 PM; Lifecycle Status: Active; Minimum Order: 15000; Mounting Type: Surface Mount, MLCC; Operating Temperature: -55°C ~ 125°C; Package / Case: 0603 (1608 Metric); packaging: TapeAndReel; partid: 2233; Part Status: Active; price: 0.01; series: SMD Comm X7R; Size / Dimension: 0.063" L x 0.031" W (1.60mm x 0.80mm); Supplier 1: DigiKey; Supplier Part Number 1: 399-7374-2-ND; Temperature Coefficient: X7R; Thickness (Max): 0.035" (0.90mm); Voltage - Rated: 50V
C29 = 12065D106KAT2A: CAP CER 10UF 50V X5R 1206; manufacturer: AVX Corporation; Tolerance: ±10%; Part Number: 12065D106KAT2A; Value: 10µF; Applications: General Purpose; Capacitance: 10µF; componentlink1description: Datasheet; componentlink1url: http://datasheets.avx.com/cx5r.pdf; componentlink2description: DigiKey Link; componentlink2url: http://digikey.com/product-detail/en/avx-corporation/12065D106KAT2A/478-9979-1-ND/6149060; Device Package: 1206 (3216 Metric); lastupdated: 9/2/2020 1:05:35 AM; Lifecycle Status: Active; Minimum Order: 1; Mounting Type: Surface Mount, MLCC; Operating Temperature: -55°C ~ 85°C; Package / Case: 1206 (3216 Metric); packaging: TapeAndReel; partid: 21345; Part Status: Active; price: 0.16; series: -; Size / Dimension: 0.126" L x 0.063" W (3.20mm x 1.60mm); Supplier 1: DigiKey; Supplier Part Number 1: 478-9979-1-ND; Temperature Coefficient: X5R; Thickness (Max): 0.071" (1.80mm); Voltage - Rated: 50V
D15 = SM712: TVS Diode (Bi-directional); Manufacturer_Name: DOWO; Datasheet Link: https://datasheet.lcsc.com/szlcsc/DOWO-SM712_C293966.pdf; Height: 1.15mm; Manufacturer_Part_Number: SM712
IC5 = MAX485ECSA+: Integrated Circuit; Manufacturer_Name: Analog Devices; Datasheet Link: http://datasheets.maximintegrated.com/en/ds/MAX1487E-MAX491E.pdf; Height: 1.75mm; Manufacturer_Part_Number: MAX485ECSA+; Mouser Part Number: 700-MAX485ECSA; Mouser Price/Stock: https://www.mouser.co.uk/ProductDetail/Analog-Devices-Maxim-Integrated/MAX485ECSA%2b?qs=1THa7WoU59Gy3FCdT5o1Tg%3D%3D; Arrow Part Number: MAX485ECSA+; Arrow Price/Stock: https://www.arrow.com/en/products/max485ecsa/analog-devices?utm_currency=USD&region=nac
J11 = 282815-3: as J3 on sheet MCU; Datasheet Link: https://www.te.com/commerce/DocumentDelivery/DDEController?Action=srchrtrv&DocNm=1-773958-1&DocType=Data%20Sheet&DocLang=English&PartCntxt=282815-3&DocFormat=pdf; Height: 8.35mm; Manufacturer_Part_Number: 282815-3; Mouser Part Number: 571-282815-3; Mouser Price/Stock: https://www.mouser.co.uk/ProductDetail/TE-Connectivity/282815-3?qs=79%2FjLZ2kXkqd6grVMiPYfw%3D%3D; Arrow Part Number: 282815-3; Arrow Price/Stock: https://www.arrow.com/en/products/282815-3/te-connectivity
R22 R27 R28 = RT0603FRE0710KL: RES SMD 10K OHM 1% 1/10W 0603; Manufacturer: Yageo; Power (Watts): 0.1W, 1/10W; Resistance: 10 kOhms; Temperature Coefficient: ±50ppm/°C; Part Number: RT0603FRE0710KL; ComponentLink1Description: Datasheet; ComponentLink1URL: https://www.yageo.com/upload/media/product/productsearch/datasheet/rchip/PYu-RT_1-to-0.01_RoHS_L_11.pdf; ComponentLink2Description: DigiKey Link; ComponentLink2URL: https://www.digikey.com/en/products/detail/yageo/RT0603FRE0710KL/1075040; Composition: Thin Film; Device Package: 0603 (1608 Metric); Height - Seated (Max): 0.022" (0.55mm); LastUpdated: 9/19/2022 1:22:31 PM; Lifecycle Status: Active; Minimum Order: 1; Number of Terminations: 2; Operating Temperature: -55°C ~ 155°C; Package / Case: 0603 (1608 Metric); Packaging: TapeAndReel; PartId: 5671; Part Status: Active; Price: 0.01; Series: RT; Size / Dimension: 0.063" L x 0.031" W (1.60mm x 0.80mm); Supplier 1: DigiKey; Supplier Part Number 1: YAG2321CT-ND; Supplier Device Package: 0603; Tolerance: ±1%
  R22 R28: Value: 20 kOhms
  R27: Value: 120
R23-R26 = RT0603FRE0710KL: RES SMD 10K OHM 1% 1/10W 0603; Manufacturer: Yageo; Power (Watts): 0.1W, 1/10W; Temperature Coefficient: ±50ppm/°C; Part Number: RT0603FRE0710KL; Value: 10 kOhms; ComponentLink1Description: Datasheet; ComponentLink1URL: https://www.yageo.com/upload/media/product/productsearch/datasheet/rchip/PYu-RT_1-to-0.01_RoHS_L_11.pdf; ComponentLink2Description: DigiKey Link; ComponentLink2URL: https://www.digikey.com/en/products/detail/yageo/RT0603FRE0710KL/1075040; Composition: Thin Film; Device Package: 0603 (1608 Metric); Height - Seated (Max): 0.022" (0.55mm); LastUpdated: 9/19/2022 1:22:31 PM; Lifecycle Status: Active; Minimum Order: 1; Number of Terminations: 2; Operating Temperature: -55°C ~ 155°C; Package / Case: 0603 (1608 Metric); Packaging: TapeAndReel; PartId: 5671; Part Status: Active; Price: 0.01; Resistance: 10 kOhms; Series: RT; Size / Dimension: 0.063" L x 0.031" W (1.60mm x 0.80mm); Supplier 1: DigiKey; Supplier Part Number 1: YAG2321CT-ND; Supplier Device Package: 0603; Tolerance: ±1%

## Sheet ADC.SchDoc
size A; SheetNumber: 6; SheetTotal: 7
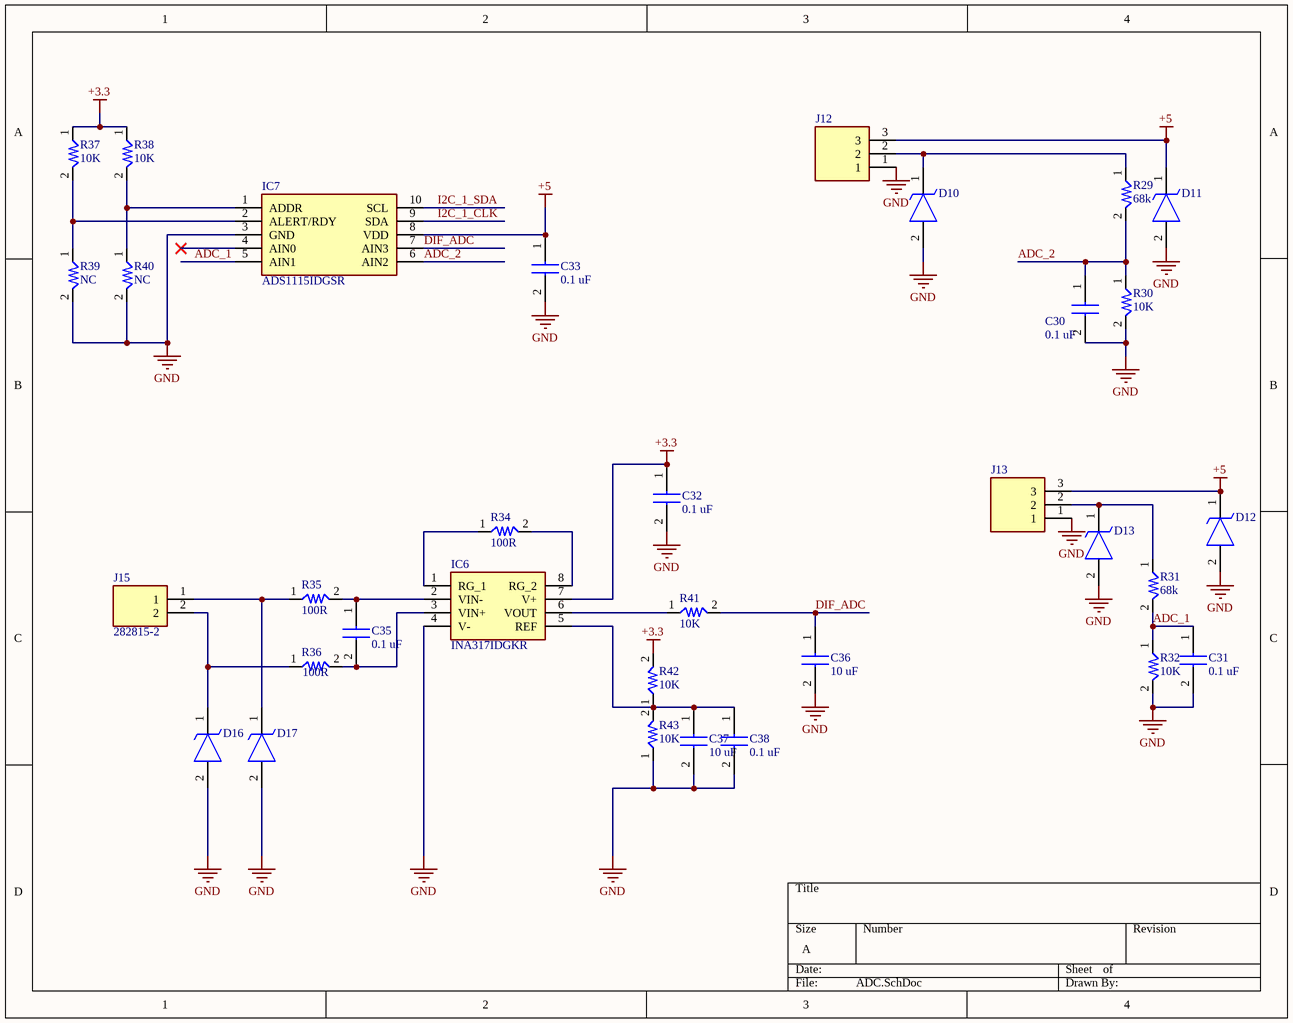
[diagram p5: ADC.SchDoc]

### Parts
C30  0.1 uF  [CAP0603]
C31  0.1 uF  [CAP0603]
C32  0.1 uF  [CAP0603]
C33  0.1 uF  [CAP0603]
C35  0.1 uF  [CAP0603]
C36  10 uF  [CAP0603]
C37  10 uF  [CAP0603]
C38  0.1 uF  [CAP0603]
D10  SMBJ5.0A  [SMBJ12A]  (value not drawn)
D11  SMBJ5.0A  [SMBJ12A]  (value not drawn)
D12  SMBJ5.0A  [SMBJ12A]  (value not drawn)
D13  SMBJ5.0A  [SMBJ12A]  (value not drawn)
D16  SMBJ5.0A  [SMBJ12A]  (value not drawn)
D17  SMBJ5.0A  [SMBJ12A]  (value not drawn)
IC6  INA317IDGKR  [SOP65P490X110-8N]
IC7  ADS1115IDGSR  [SOP50P490X110-10N]
J12  282815-3  [2828153]  (value not drawn)
J13  282815-3  [2828153]  (value not drawn)
J15  282815-2  [SHDRRA2W102P0X508_1X2_1016X1200X850P]
R29  68k  [RES0603]
R30  10K  [RES0603]
R31  68k  [RES0603]
R32  10K  [RES0603]
R34  100R  [RES0603]
R35  100R  [RES0603]
R36  100R  [RES0603]
R37  10K  [RES0603]
R38  10K  [RES0603]
R39  NC  [RES0603]
R40  NC  [RES0603]
R41  10K  [RES0603]
R42  10K  [RES0603]
R43  10K  [RES0603]

### Nets
+3.3: C32.1 IC6.7(V+) R37.1 R38.1 R42.2
+5: C33.1 D11.1(K) D12.1(K) IC7.8(VDD) J12.3 J13.3
GND: C30.2 C31.2 C32.2 C33.2 C36.2 C37.2 C38.2 D10.2(A) D11.2(A) D12.2(A) D13.2(A) D16.2(A) D17.2(A) IC6.4(V-) IC7.3(GND) J12.1 J13.1 R30.2 R32.2 R39.2 R40.2 R43.1
ADC_1: C31.1 IC7.5(AIN1) R31.2 R32.1
ADC_2: C30.1 IC7.6(AIN2) R29.2 R30.1
DIF_ADC: C36.1 IC7.7(AIN3) R41.2
I2C_1_CLK: IC7.9(SDA)
I2C_1_SDA: IC7.10(SCL)
NetC35_1: C35.1 IC6.2(VIN-) R35.2
NetC35_2: C35.2 IC6.3(VIN+) R36.2
NetC37_1: C37.1 C38.1 IC6.5(REF) R42.1 R43.2
NetD10_1: D10.1(K) J12.2 R29.1
NetD13_1: D13.1(K) J13.2 R31.1
NetD16_1: D16.1(K) J15.2 R36.1
NetD17_1: D17.1(K) J15.1 R35.1
NetIC6_1: IC6.1(RG_1) R34.1
NetIC6_6: IC6.6(VOUT) R41.1
NetIC6_8: IC6.8(RG_2) R34.2
NetIC7_1: IC7.1(ADDR) R38.2 R40.1
NetIC7_2: IC7.2(ALERT/RDY) R37.2 R39.1

Not connected (* = marked no-connect by the designer): IC7 4(AIN0)*

### Library data of the parts
C30-C33 C35-C38 = CC0603KRX7R9BB104: Capacitor; Manufacturer_Name: YAGEO; Datasheet Link: https://componentsearchengine.com/Datasheets/2/CC0603KRX7R9BB104.pdf; Height: 0.9mm; Manufacturer_Part_Number: CC0603KRX7R9BB104; Mouser Part Number: 603-CC603KRX7R9BB104; Mouser Price/Stock: https://www.mouser.co.uk/ProductDetail/YAGEO/CC0603KRX7R9BB104?qs=vTakOoo5QyLvVCYM2ge8LQ%3D%3D; Arrow Part Number: CC0603KRX7R9BB104; Arrow Price/Stock: https://www.arrow.com/en/products/cc0603krx7r9bb104/yageo?utm_currency=USD&region=europe
D10-D13 D16 D17 = SMBJ5.0A: TVS Diode (Uni-directional); Manufacturer_Name: STMicroelectronics; Datasheet Link: https://www.st.com/resource/en/datasheet/smbj12a.pdf; Height: 2.45mm; Manufacturer_Part_Number: SMBJ5.0A
IC6 = INA317IDGKR: Integrated Circuit; Manufacturer_Name: Texas Instruments; Datasheet Link: http://www.ti.com/lit/gpn/ina317; Height: 1.1mm; Manufacturer_Part_Number: INA317IDGKR; Mouser Part Number: 595-INA317IDGKR; Mouser Price/Stock: https://www.mouser.co.uk/ProductDetail/Texas-Instruments/INA317IDGKR?qs=W0yvOO0ixfHq371pIwwl1g%3D%3D; Arrow Part Number: INA317IDGKR; Arrow Price/Stock: https://www.arrow.com/en/products/ina317idgkr/texas-instruments?utm_currency=USD&region=nac
IC7 = ADS1115IDGSR: Integrated Circuit; Manufacturer_Name: Texas Instruments; Datasheet Link: http://www.ti.com/lit/gpn/ADS1115; Height: 1.1mm; Manufacturer_Part_Number: ADS1115IDGSR; Mouser Part Number: 595-ADS1115IDGSR; Mouser Price/Stock: https://www.mouser.co.uk/ProductDetail/Texas-Instruments/ADS1115IDGSR?qs=IK5e5L0zOXjKCJoVMhYO%2FQ%3D%3D; Arrow Part Number: ADS1115IDGSR; Arrow Price/Stock: https://www.arrow.com/en/products/ads1115idgsr/texas-instruments.html?utm_currency=USD&region=nac
J12 J13 = 282815-3: as J3 on sheet MCU; Datasheet Link: https://www.te.com/commerce/DocumentDelivery/DDEController?Action=srchrtrv&DocNm=1-773958-1&DocType=Data%20Sheet&DocLang=English&PartCntxt=282815-3&DocFormat=pdf; Height: 8.35mm; Manufacturer_Part_Number: 282815-3; Mouser Part Number: 571-282815-3; Mouser Price/Stock: https://www.mouser.co.uk/ProductDetail/TE-Connectivity/282815-3?qs=79%2FjLZ2kXkqd6grVMiPYfw%3D%3D; Arrow Part Number: 282815-3; Arrow Price/Stock: https://www.arrow.com/en/products/282815-3/te-connectivity
J15 = 282815-2: as J4 on sheet MCU; Datasheet Link: https://www.te.com/commerce/DocumentDelivery/DDEController?Action=srchrtrv&DocNm=1-773958-1&DocType=Data%20Sheet&DocLang=English&PartCntxt=282815-2&DocFormat=pdf; Height: 8.5mm; Manufacturer_Part_Number: 282815-2; Mouser Part Number: 571-282815-2; Mouser Price/Stock: https://www.mouser.co.uk/ProductDetail/TE-Connectivity/282815-2?qs=79%2FjLZ2kXkpF7MFURi982A%3D%3D; Arrow Part Number: 282815-2; Arrow Price/Stock: https://www.arrow.com/en/products/282815-2/te-connectivity?region=nac
R29-R32 R34-R43 = RES: as R3 on sheet MCU; Datasheet Link: https://datasheet.lcsc.com/szlcsc/Uniroyal-Elec-0603WAF1001T5E_C21190.pdf; Height: 0.55mm

## Sheet DAC_OUT.SchDoc
size A; SheetNumber: 7; SheetTotal: 7
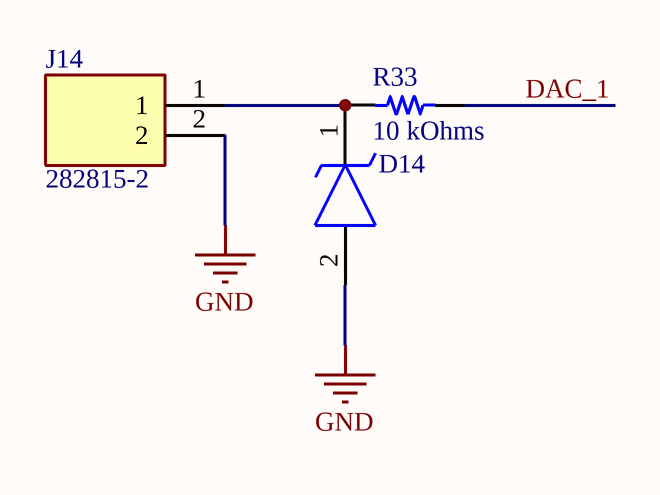
[diagram p6: DAC_OUT.SchDoc]

### Parts
D14  SMBJ5.0A  [SMBJ12A]  (value not drawn)
J14  282815-2  [SHDRRA2W102P0X508_1X2_1016X1200X850P]
R33  10 kOhms  [RES 0603_1608]

### Nets
GND: D14.2(A) J14.2
DAC_1: R33.1
NetD14_1: D14.1(K) J14.1 R33.2

### Library data of the parts
D14 = SMBJ5.0A: as D10 on sheet ADC; Datasheet Link: https://www.st.com/resource/en/datasheet/smbj12a.pdf; Height: 2.45mm; Manufacturer_Part_Number: SMBJ5.0A
J14 = 282815-2: as J4 on sheet MCU; Datasheet Link: https://www.te.com/commerce/DocumentDelivery/DDEController?Action=srchrtrv&DocNm=1-773958-1&DocType=Data%20Sheet&DocLang=English&PartCntxt=282815-2&DocFormat=pdf; Height: 8.5mm; Manufacturer_Part_Number: 282815-2; Mouser Part Number: 571-282815-2; Mouser Price/Stock: https://www.mouser.co.uk/ProductDetail/TE-Connectivity/282815-2?qs=79%2FjLZ2kXkpF7MFURi982A%3D%3D; Arrow Part Number: 282815-2; Arrow Price/Stock: https://www.arrow.com/en/products/282815-2/te-connectivity?region=nac
R33 = RT0603FRE0710KL: as R23 on sheet RS485; Part Number: RT0603FRE0710KL; Value: 10 kOhms; ComponentLink1Description: Datasheet; ComponentLink1URL: https://www.yageo.com/upload/media/product/productsearch/datasheet/rchip/PYu-RT_1-to-0.01_RoHS_L_11.pdf; ComponentLink2Description: DigiKey Link; ComponentLink2URL: https://www.digikey.com/en/products/detail/yageo/RT0603FRE0710KL/1075040; Composition: Thin Film; Device Package: 0603 (1608 Metric); Height - Seated (Max): 0.022" (0.55mm); LastUpdated: 9/19/2022 1:22:31 PM; Lifecycle Status: Active; Minimum Order: 1; Number of Terminations: 2; Operating Temperature: -55°C ~ 155°C; Package / Case: 0603 (1608 Metric); Packaging: TapeAndReel; PartId: 5671; Part Status: Active; Price: 0.01; Resistance: 10 kOhms; Series: RT; Size / Dimension: 0.063" L x 0.031" W (1.60mm x 0.80mm); Supplier 1: DigiKey; Supplier Part Number 1: YAG2321CT-ND; Supplier Device Package: 0603; Tolerance: ±1%

## Nets that join several sheets
+3.3: MCU (12 pins), PWR (C12.2 C13.2 IC3.1 L1.2), RS485 (R23.2 R24.2 R25.2 R26.2), ADC (5 pins)
+4.1V: PWR (C18.2 C19.2 L2.2 R13.2), GSM (5 pins)
+5: MCU (Q1.3), PWR (C22.2 C23.2 L3.2 R15.2), ADC (6 pins)
GND: programmer (14 pins), MCU (32 pins), PWR (19 pins), GSM (27 pins), RS485 (6 pins), ADC (22 pins), DAC_OUT (D14.2 J14.2)
BOOT: programmer (U1.13), MCU (5 pins)
DAC_1: MCU (IC1.10), DAC_OUT (R33.1)
DBG_RX: programmer (U1.2), MCU (IC1.35)
DBG_TX: programmer (U1.3), MCU (IC1.34)
DE: MCU (IC1.13), RS485 (IC5.2 IC5.3 R24.1 R25.1)
DI: MCU (IC1.12), RS485 (IC5.4 R23.1)
I2C_1_CLK: MCU (D4.2 IC1.37 J2.2 R6.1), ADC (IC7.9)
I2C_1_SDA: MCU (D5.2 IC1.36 J2.1 R5.1), ADC (IC7.10)
NRST: programmer (U1.14), MCU (5 pins)
RO: MCU (IC1.11), RS485 (IC5.1 R26.1)
SIM_EN: MCU (IC1.26), GSM (R18.2)
SIM_RX: MCU (IC1.27), GSM (J7.3 U2.1)
SIM_TX: MCU (IC1.28), GSM (J7.2 U2.2)